# Altium schematic sheet ESP32主控_20241002.SchDoc
size A4
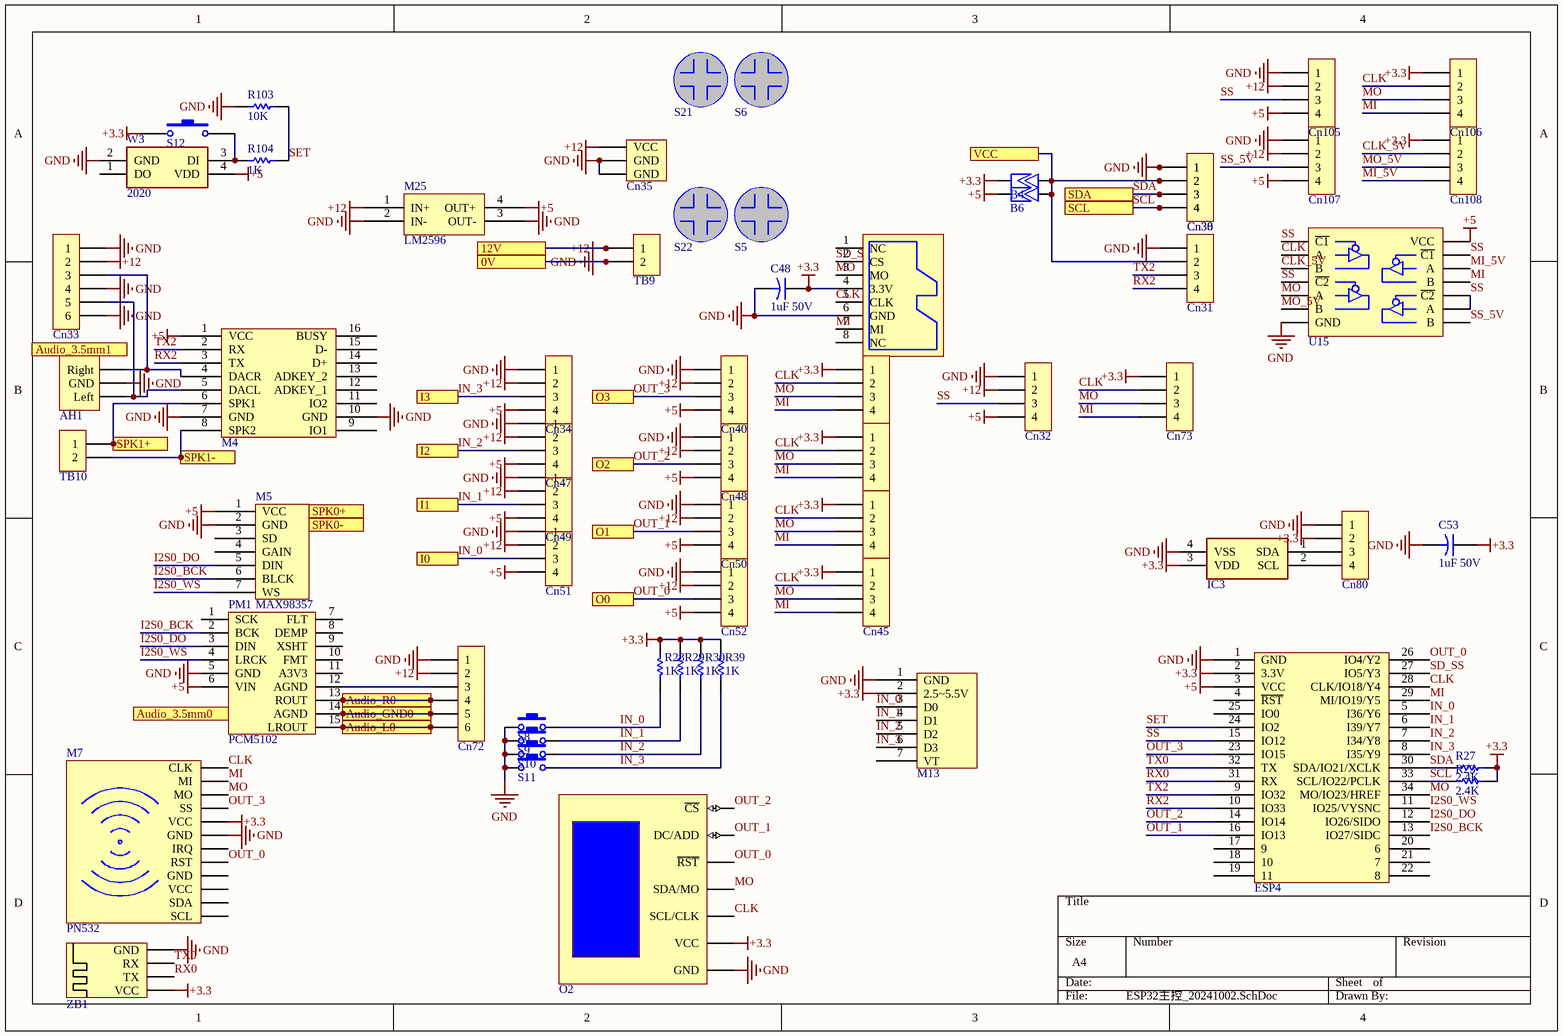
[diagram p0: ESP32主控_20241002.SchDoc]

## Parts
AH1  Interface_Audio_hole  [Audio_hole_DIP]  (value not drawn)
B4  短路  [BYPASS-0805]  (value not drawn)
B6  不短路  [BYPASS-0805]  (value not drawn)
C48  1uF 50V  [Cap-1206]
C53  1uF 50V  [Cap-1206]
Cn28  KF2510  [Connector_KF2510-4A]  (value not drawn)
Cn29  KF2510  [Connector_KF2510-4A]  (value not drawn)
Cn30  KF2510  [Connector_KF2510-4A]  (value not drawn)
Cn31  KF2510  [Connector_KF2510-4A]  (value not drawn)
Cn32  KF2510  [Connector_KF2510-4A]  (value not drawn)
Cn33  KF2510-6  [Connector_KF2510-6W]  (value not drawn)
Cn34  KF2510  [Connector_KF2510-4A]  (value not drawn)
Cn35  DC-005  [Connector_DC-005]  (value not drawn)
Cn38  KF2510  [Connector_KF2510-4A]  (value not drawn)
Cn40  KF2510  [Connector_KF2510-4A]  (value not drawn)
Cn43  KF2510  [Connector_KF2510-4A]  (value not drawn)
Cn45  KF2510  [Connector_KF2510-4A]  (value not drawn)
Cn47  KF2510  [Connector_KF2510-4A]  (value not drawn)
Cn48  KF2510  [Connector_KF2510-4A]  (value not drawn)
Cn49  KF2510  [Connector_KF2510-4A]  (value not drawn)
Cn50  KF2510  [Connector_KF2510-4A]  (value not drawn)
Cn51  KF2510  [Connector_KF2510-4A]  (value not drawn)
Cn52  KF2510  [Connector_KF2510-4A]  (value not drawn)
Cn72  KF2510-6  [Connector_KF2510-6W]  (value not drawn)
Cn73  KF2510  [Connector_KF2510-4A]  (value not drawn)
Cn80  KF2510  [Connector_KF2510-4A]  (value not drawn)
Cn105  KF2510  [Connector_KF2510-4A]  (value not drawn)
Cn106  KF2510  [Connector_KF2510-4A]  (value not drawn)
Cn107  KF2510  [Connector_KF2510-4A]  (value not drawn)
Cn108  KF2510  [Connector_KF2510-4A]  (value not drawn)
ESP4  U?  [ESP32-WROVER-CAM Module]  (value not drawn)
IC3  SHT40  [Sensor_SHT40]  (value not drawn)
M4  BY8001-16P  [BY8001-16P]  (value not drawn)
M5  MAX98357  [MAX98357_Module]
M7  PN532  [PN532]
M13  XR390  [XR390 Module]  (value not drawn)
M25  LM2596  [LM2596 Module]
MS4  Interface_MicroSD card slot  [Interface_MicroSD card slot]  (value not drawn)
O2  0.96"  [OLED-SPI/I2C]  (value not drawn)
PM1  PCM5102  [PCM5102_MODULE]
R23  2.4K  [Res-1206]
R27  2.4K  [Res-1206]
R28  1K  [Res-1206]
R29  1K  [Res-1206]
R30  1K  [Res-1206]
R39  1K  [Res-1206]
R103  10K  [Res-1206]
R104  1K  [Res-1206]
S5  M3  [Screw M3]  (value not drawn)
S6  M3  [Screw M3]  (value not drawn)
S8  Switch  [Switch SMD-3.6*6*2.5]  (value not drawn)
S9  Switch  [Switch SMD-3.6*6*2.5]  (value not drawn)
S10  Switch  [Switch SMD-3.6*6*2.5]  (value not drawn)
S11  Switch  [Switch SMD-3.6*6*2.5]  (value not drawn)
S12  Switch  [Switch SMD-3.6*6*2.5]  (value not drawn)
S21  M3  [Screw M3]  (value not drawn)
S22  M3  [Screw M3]  (value not drawn)
TB9  ZB25(2P)  [Terminal block(KF2EDGR-5.08 _2P)]  (value not drawn)
TB10  ZB25(2P)  [Terminal block(KF2EDGR-5.08 _2P)]  (value not drawn)
U15  74HC125  [SOP-14]  (value not drawn)
W3  2020  [LED-WS2812B-5050]
ZB1  Zigbee  [ZIGBEE]  (value not drawn)

## Ports
0V, 12V, Audio_3.5mm0, Audio_3.5mm1, Audio_GND0, Audio_L0, Audio_R0, I0, I1, I2, I3, O0, O1, O2, O3, SCL, SDA, SPK0+, SPK0-, SPK1+, SPK1-, VCC

## Nets
+3.3: B4.1 C48.1 C53.1 Cn28.1 Cn29.1 Cn43.1 Cn45.1 Cn73.1 Cn80.2 Cn106.1 Cn108.1 ESP4.2(3.3V) IC3.3(VDD) M7.5(VCC) M13.2(2.5~5.5V) MS4.4(3.3V) O2.2(VCC) R23.2 R27.2 R28.2 R29.2 R30.2 R39.2 S12.1 ZB1.1(VCC)
+5: B6.1 Cn32.4 Cn34.4 Cn40.4 Cn47.4 Cn48.4 Cn49.4 Cn50.4 Cn51.4 Cn52.4 Cn105.4 Cn107.4 ESP4.3(VCC) M4.1(VCC) M5.1(VCC) M25.4(OUT+) PM1.6(VIN) U15.14(VCC) W3.4(VDD)
+12: Cn32.2 Cn33.2 Cn34.2 Cn35.1(VCC) Cn40.2 Cn47.2 Cn48.2 Cn49.2 Cn50.2 Cn51.2 Cn52.2 Cn72.2 Cn105.2 Cn107.2 M25.1(IN+) TB9.1 ; port 12V
GND: AH1.1(GND) C48.2 C53.2 Cn30.1 Cn31.1 Cn32.1 Cn33.1 Cn33.4 Cn33.6 Cn34.1 Cn35.2(GND) Cn35.3(GND) Cn38.1 Cn40.1 Cn47.1 Cn48.1 Cn49.1 Cn50.1 Cn51.1 Cn52.1 Cn72.1 Cn80.1 Cn105.1 Cn107.1 ESP4.1(GND) IC3.4(VSS) M4.7(GND) M4.10(GND) M5.2(GND) M7.6(GND) M13.1(GND) M25.2(IN-) M25.3(OUT-) MS4.6(GND) O2.1(GND) PM1.5(GND) R103.1 S8.1 S9.1 S10.1 S11.1 TB9.2 U15.7(GND) W3.2(GND) ZB1.4(GND) ; port 0V
Audio_GND0: Cn72.5 PM1.14(AGND) ; port Audio_GND0
Audio_L0: Cn72.6 PM1.15(LROUT) ; port Audio_L0
Audio_R0: Cn72.4 PM1.13(ROUT) ; port Audio_R0
CLK: Cn28.2 Cn29.2 Cn43.2 Cn45.2 Cn73.2 Cn106.2 ESP4.28(CLK/IO18/Y4) M7.1(CLK) MS4.5(CLK) O2.3(SCL/CLK) U15.2(A)
CLK_5V: Cn108.2 U15.3(B)
I2S0_BCK: ESP4.13(IO27/SIDC) M5.6(BLCK) PM1.2(BCK)
I2S0_DO: ESP4.12(IO26/SIDO) M5.5(DIN) PM1.3(DIN)
I2S0_WS: ESP4.11(IO25/VYSNC) M5.7(WS) PM1.4(LRCK)
IN_0: Cn51.3 ESP4.5(I36/Y6) M13.3(D0) R28.1 S8.2 ; port I0
IN_1: Cn49.3 ESP4.6(I39/Y7) M13.4(D1) R29.1 S9.2 ; port I1
IN_2: Cn47.3 ESP4.7(I34/Y8) M13.5(D2) R30.1 S10.2 ; port I2
IN_3: Cn34.3 ESP4.8(I35/Y9) M13.6(D3) R39.1 S11.2 ; port I3
MI: Cn28.4 Cn29.4 Cn43.4 Cn45.4 Cn73.4 Cn106.4 ESP4.29(MI/IO19/Y5) M7.2(MI) MS4.7(MI) U15.11(B)
MI_5V: Cn108.4 U15.12(A)
MO: Cn28.3 Cn29.3 Cn43.3 Cn45.3 Cn73.3 Cn106.3 ESP4.34(MO/IO23/HREF) M7.3(MO) MS4.3(MO) O2.4(SDA/MO) U15.5(A)
MO_5V: Cn108.3 U15.6(B)
OUT_0: Cn52.3 ESP4.26(IO4/Y2) M7.8(RST) O2.5(~{RST}) ; port O0
OUT_1: Cn50.3 ESP4.16(IO13) O2.6(DC/ADD) ; port O1
OUT_2: Cn48.3 ESP4.14(IO14) O2.7(~{CS}) ; port O2
OUT_3: Cn40.3 ESP4.23(IO15) M7.4(SS) ; port O3
RX0: ESP4.31(RX) ZB1.2(TX)
RX2: Cn31.4 ESP4.10(IO33) M4.3(TX)
SCL: Cn30.4 Cn38.4 ESP4.33(SCL/IO22/PCLK) R23.1 ; port SCL
SD_SS: ESP4.27(IO5/Y3) MS4.2(CS)
SDA: Cn30.3 Cn38.3 ESP4.30(SDA/IO21/XCLK) R27.1 ; port SDA
SET: ESP4.24(IO2) R103.2 R104.2
SPK1+: M4.6(SPK1) TB10.1 ; port SPK1+
SPK1-: M4.8(SPK2) TB10.2 ; port SPK1-
SS: Cn32.3 Cn105.3 ESP4.15(IO12) U15.1(~{C1}) U15.4(~{C2}) U15.9(A) U15.10(~{C2}) U15.13(~{C1})
SS_5V: Cn107.3 U15.8(B)
TX0: ESP4.32(TX) ZB1.3(RX)
TX2: Cn31.3 ESP4.9(IO32) M4.2(RX)
VCC: B4.2 B6.2 Cn30.2 Cn31.2 Cn38.2 ; port VCC
NetAH1_2: AH1.2(Left) Cn33.5 M4.5(DACL)
NetAH1_3: AH1.3(Right) Cn33.3 M4.4(DACR)
NetCn72_3: Cn72.3 PM1.12(AGND)
NetCn80_3: Cn80.3 IC3.1(SDA)
NetCn80_4: Cn80.4 IC3.2(SCL)
NetR104_1: R104.1 S12.2 W3.3(DI)

Not connected (* = marked no-connect by the designer): ESP4 4(~{RST}) 17(9) 18(10) 19(11) 20(6) 21(7) 22(8) 25(IO0); M4 9(IO1) 11(IO2) 12(ADKEY_1) 13(ADKEY_2) 14(D+) 15(D-) 16(BUSY); M5 3(SD) 4(GAIN); M7 7(IRQ) 9(GND) 10(VCC) 11(SDA) 12(SCL); M13 7(VT); MS4 1(NC) 8(NC); PM1 1(SCK) 7(FLT) 8(DEMP) 9(XSHT) 10(FMT) 11(A3V3); W3 1(DO)

## Library data of the parts
AH1 = Interface_Audio_hole: 音源孔
B4 B6 = Bypass: 短路焊點(如標註短路則需額外補錫使其短路)
C48 C53 = Cap: 電容; ComponentLink1Description: datasheet; ComponentLink1URL: https://product.tdk.com/system/files/dam/doc/product/capacitor/ceramic/mlcc/catalog/mlcc_commercial_general_en.pdf
Cn28-Cn32 Cn34 Cn38 Cn40 Cn43 Cn45 Cn47-Cn52 Cn73 Cn80 Cn105-Cn108 = Contact(4P): 接線端子
Cn33 Cn72 = Contact(6P): 接線端子
Cn35 = Contact_DC: DC直流接頭
ESP4 = ESP32-WROVER-CAM: WIFI通訊模組,帶OV2640攝像頭
IC3 = Sensor_SHT40-AD1B-R3: I2C,溫溼度感測器; Manufacturer_Name: Sensirion; Datasheet Link: https://www.arrow.com/en/products/sht40-ad1b-r3/sensirion-ag; Height: 0.59mm; Manufacturer_Part_Number: SHT40-AD1B-R3
M4 = Mini MP3 Player: TTL通訊SD卡撥放mp3模組
M5 = MAX98357 Module: I2S音頻直驅模組,3W
M7 = PN532: NFC模組
M13 = XR390: 遙控器模組
M25 = LM2596: DC to DC 降壓模組
MS4 = Interface_MicroSD card slot: Micro SD 卡座
O2 = OLED_SPI/I2C: OLED顯示模組
PM1 = PCM5102: I2S音頻解碼模組
R23 R27-R30 R39 R103 R104 = Res: 電阻
S5 S6 S21 S22 = Screw: 螺絲(非焊接元件)
S8-S12 = Switch: 開關_按鍵
TB9 TB10 = Terminal block(2P): 端子台
U15 = 74HC125: 緩衝器
W3 = WS2812B: LED幻彩燈珠; Manufacturer_Name: Adafruit; Manufacturer_Part_Number: 4684; Datasheet Link: https://cdn-shop.adafruit.com/product-files/4684/4684_WS2812B-2020_V1.3_EN.pdf; Height: 0.84mm; Mouser Part Number: 485-4684; Mouser Price/Stock: https://www.mouser.co.uk/ProductDetail/Adafruit/4684?qs=DPoM0jnrROWIv9%2FMCIm5vw%3D%3D; Arrow Part Number: 4684; Arrow Price/Stock: https://www.arrow.com/en/products/4684/adafruit-industries?region=nac
ZB1 = Zigbee: 無線通訊模組